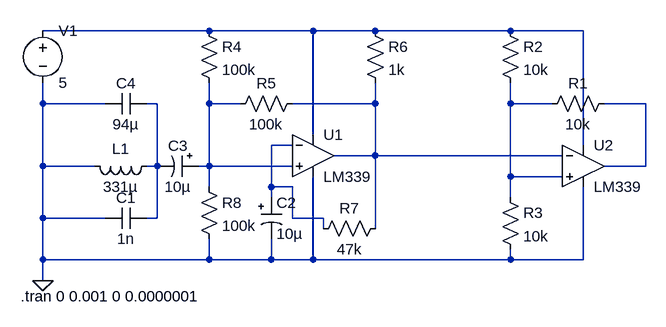
[diagram p0: schematic main.asc]
main.asc, the LTspice schematic file:
Version 4
SHEET 1 880 680
WIRE -16 -16 -272 -16
WIRE 144 -16 -16 -16
WIRE 240 -16 144 -16
WIRE 448 -16 240 -16
WIRE 560 -16 448 -16
WIRE -272 96 -272 64
WIRE -176 96 -272 96
WIRE -96 96 -112 96
WIRE -16 96 -16 64
WIRE 32 96 -16 96
WIRE 240 96 240 64
WIRE 240 96 112 96
WIRE 448 96 448 64
WIRE 512 96 448 96
WIRE 656 96 592 96
WIRE 144 144 144 -16
WIRE 112 160 80 160
WIRE 560 160 560 -16
WIRE 240 176 240 96
WIRE 240 176 176 176
WIRE 528 176 240 176
WIRE -272 192 -272 96
WIRE -192 192 -272 192
WIRE -96 192 -96 96
WIRE -96 192 -112 192
WIRE -16 192 -16 96
WIRE -16 192 -32 192
WIRE 112 192 -16 192
WIRE 656 192 656 96
WIRE 656 192 592 192
WIRE 448 208 448 96
WIRE 528 208 448 208
WIRE -16 224 -16 192
WIRE 80 224 80 160
WIRE 112 224 80 224
WIRE 80 240 80 224
WIRE 448 240 448 208
WIRE -272 272 -272 192
WIRE -176 272 -272 272
WIRE -96 272 -96 192
WIRE -96 272 -112 272
WIRE 112 272 112 224
WIRE 160 272 112 272
WIRE 160 288 160 272
WIRE 240 288 240 176
WIRE -272 336 -272 272
WIRE -16 336 -16 304
WIRE -16 336 -272 336
WIRE 80 336 80 304
WIRE 80 336 -16 336
WIRE 144 336 144 208
WIRE 144 336 80 336
WIRE 448 336 448 320
WIRE 448 336 144 336
WIRE 560 336 560 224
WIRE 560 336 448 336
WIRE -272 368 -272 336
FLAG -272 368 0
SYMBOL Comparators\\LM339 144 112 R0
SYMATTR InstName U1
SYMBOL Comparators\\LM339 560 128 R0
SYMATTR InstName U2
SYMBOL res 608 80 R90
WINDOW 0 0 56 VBottom 2
WINDOW 3 32 56 VTop 2
SYMATTR InstName R1
SYMATTR Value 10k
SYMBOL res 432 -32 R0
SYMATTR InstName R2
SYMATTR Value 10k
SYMBOL res 432 224 R0
SYMATTR InstName R3
SYMATTR Value 10k
SYMBOL res -32 -32 R0
SYMATTR InstName R4
SYMATTR Value 100k
SYMBOL res 128 80 R90
WINDOW 0 0 56 VBottom 2
WINDOW 3 32 56 VTop 2
SYMATTR InstName R5
SYMATTR Value 100k
SYMBOL res 224 -32 R0
SYMATTR InstName R6
SYMATTR Value 1k
SYMBOL res 144 304 R270
WINDOW 0 32 56 VTop 2
WINDOW 3 0 56 VBottom 2
SYMATTR InstName R7
SYMATTR Value 47k
SYMBOL res -32 208 R0
SYMATTR InstName R8
SYMATTR Value 100k
SYMBOL ind -96 176 R90
WINDOW 0 5 56 VBottom 2
WINDOW 3 32 56 VTop 2
SYMATTR InstName L1
SYMATTR Value 331µ
SYMATTR SpiceLine Rser=0
SYMBOL cap -112 256 R90
WINDOW 0 0 32 VBottom 2
WINDOW 3 32 32 VTop 2
SYMATTR InstName C1
SYMATTR Value 1n
SYMBOL polcap 64 240 R0
WINDOW 3 24 56 Left 2
SYMATTR InstName C2
SYMATTR Value 10µ
SYMATTR Description Capacitor
SYMATTR Type cap
SYMATTR SpiceLine V=16 Irms=35m Rser=2.8 Lser=0 mfg="Nichicon" pn="UPR1C100MAH" type="Al electrolytic"
SYMBOL polcap -32 176 R90
WINDOW 0 0 32 VBottom 2
WINDOW 3 32 32 VTop 2
SYMATTR InstName C3
SYMATTR Value 10µ
SYMATTR Description Capacitor
SYMATTR Type cap
SYMATTR SpiceLine V=16 Irms=35m Rser=2.8 Lser=0 mfg="Nichicon" pn="UPR1C100MAH" type="Al electrolytic"
SYMBOL voltage -272 -32 R0
WINDOW 123 0 0 Left 2
WINDOW 39 0 0 Left 2
SYMATTR InstName V1
SYMATTR Value 5
SYMBOL cap -112 80 R90
WINDOW 0 0 32 VBottom 2
WINDOW 3 32 32 VTop 2
SYMATTR InstName C4
SYMATTR Value 94µ
TEXT -306 392 Left 2 !.tran 0 0.001 0 0.0000001

The netlist it stands for:
* main.asc
XU1 N003 N007 N001 0 N004 LM339  ; pins In+ In- V+ V- OUT
XU2 N005 N004 N001 0 N006 LM339  ; pins In+ In- V+ V- OUT
R1 N006 N005 10k
R2 N001 N005 10k
R3 N005 0 10k
R4 N001 N003 100k
R5 N004 N003 100k
R6 N001 N004 1k
R7 N007 N004 47k
R8 N003 0 100k
L1 N002 0 331µ Rser=0
C1 N002 0 1n
C2 N007 0 10µ V=16 Irms=35m Rser=2.8 Lser=0 mfg="Nichicon" pn="UPR1C100MAH" type="Al electrolytic"
C3 N003 N002 10µ V=16 Irms=35m Rser=2.8 Lser=0 mfg="Nichicon" pn="UPR1C100MAH" type="Al electrolytic"
V1 N001 0 5
C4 N002 0 94µ
.tran 0 0.001 0 0.0000001
.lib LM339.sub
.backanno
.end